# EAGLE design Hot (EAGLE 7.7.0)
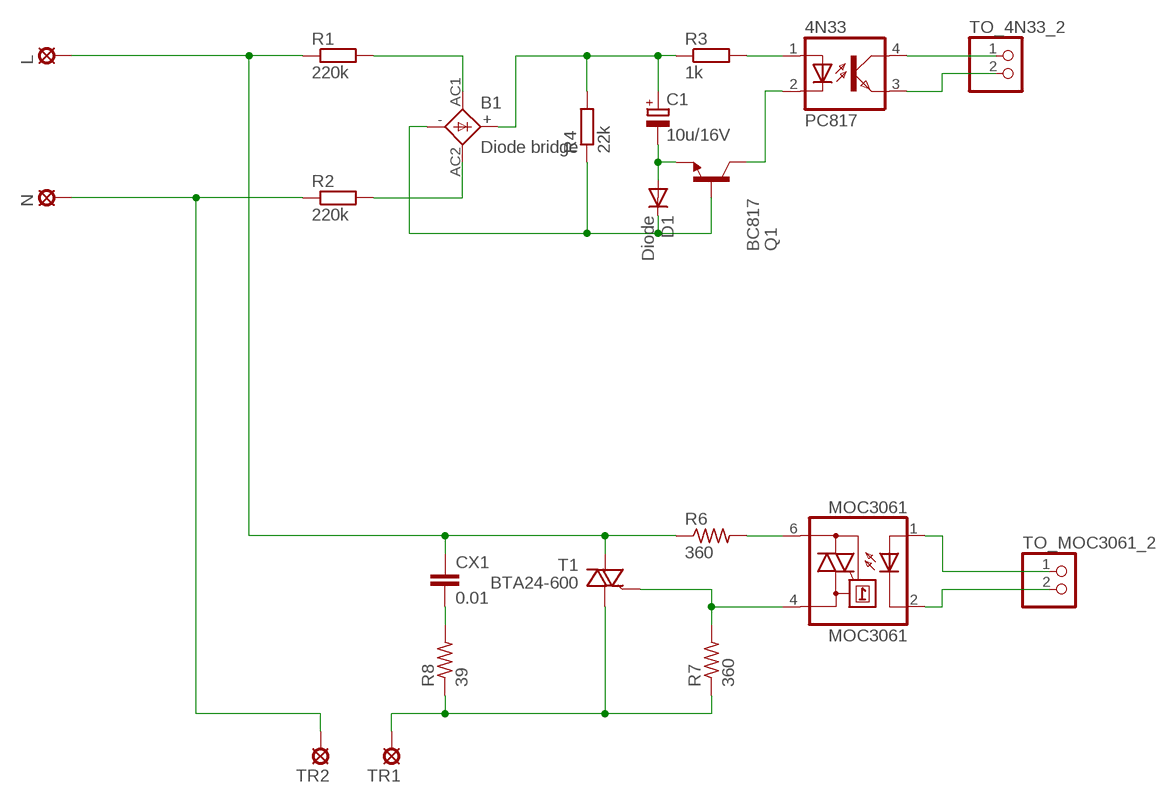
[diagram p0: schematic, sheet 1]

## Parts
4N33  PC817  [DIL04]
B1  Diode bridge  2KBB-R  [2KBB-R]
C1  10u/16V  CPOL-EUE2.5-5  [E2,5-5]
CX1  0.01  CXXC10B6  [XC10B6]
D1  Diode  DIODE-DO-214AC  [DO-214AC]
L  LSP10  [LSP10]
MOC3061  MOC3061  IL410  [DIL06]
N  LSP10  [LSP10]
Q1  BC817  BC817-16LT1SMD  [SOT23-BEC]
R1  220k  R-EU_M1206  [M1206]
R2  220k  R-EU_M1206  [M1206]
R3  1k  R-EU_M1206  [M1206]
R4  22k  R-EU_M1206  [M1206]
R6  360  R-US_VTA54  [VTA54]
R7  360  R-US_VTA54  [VTA54]
R8  39  R-US_VTA52  [VTA52]
T1  BTA24-600  TIC225S  [TO220DS]
TO_4N33_2  PINHD-1X2  [1X02]
TO_MOC3061_2  PINHD-1X2  [1X02]
TR1  LSP10  [LSP10]
TR2  LSP10  [LSP10]

## Nets
L: CX1.1 L.MP R1.1 R6.1 T1.A2
N: N.MP R2.1 TR2.MP
N$1: 4N33.2(C) Q1.C
N$2: C1.- D1.A Q1.E
N$3: 4N33.1(A) R3.2
N$4: B1.AC1 R1.2
N$5: B1.- D1.C Q1.B R4.1
N$6: B1.+ C1.+ R3.1 R4.2
N$7: B1.AC2 R2.2
N$8: MOC3061.4(A1) R7.2 T1.G
N$9: MOC3061.6(A2) R6.2
N$10: CX1.2 R8.2
N$11: R7.1 R8.1 T1.A1 TR1.MP
N$12: 4N33.4(COL) TO_4N33_2.1
N$27: 4N33.3(EMIT) TO_4N33_2.2
N$29: MOC3061.2(C) TO_MOC3061_2.2
TO_MOC3061: MOC3061.1(A) TO_MOC3061_2.1

## Library data of the parts
4N33 = optocoupler:PC817: SHARP OPTO COUPLER
B1 = rectifier:2KBB-R: RECTIFIER grid 3 x 5 mm
C1 = rcl:CPOL-EU: POLARIZED CAPACITOR, European symbol
CX1 = rcl:CX: X CAPACITOR for power line
D1 = diode:DIODE-: DIODE
L N TR1 TR2 = solpad:LSP10: SOLDER PAD drill 1.0 mm, distributor Buerklin, 12H555
MOC3061 = optocoupler:IL410: SIEMENS OPTO COUPLER
Q1 = transistor-npn:BC817*: NPN Transistor
R1-R4 = rcl:R-EU_: RESISTOR, European symbol
R6-R8 = rcl:R-US_: RESISTOR, American symbol
T1 = triac:TIC225S: TRIAC
TO_4N33_2 TO_MOC3061_2 = pinhead:PINHD-1X2: PIN HEADER

## Board
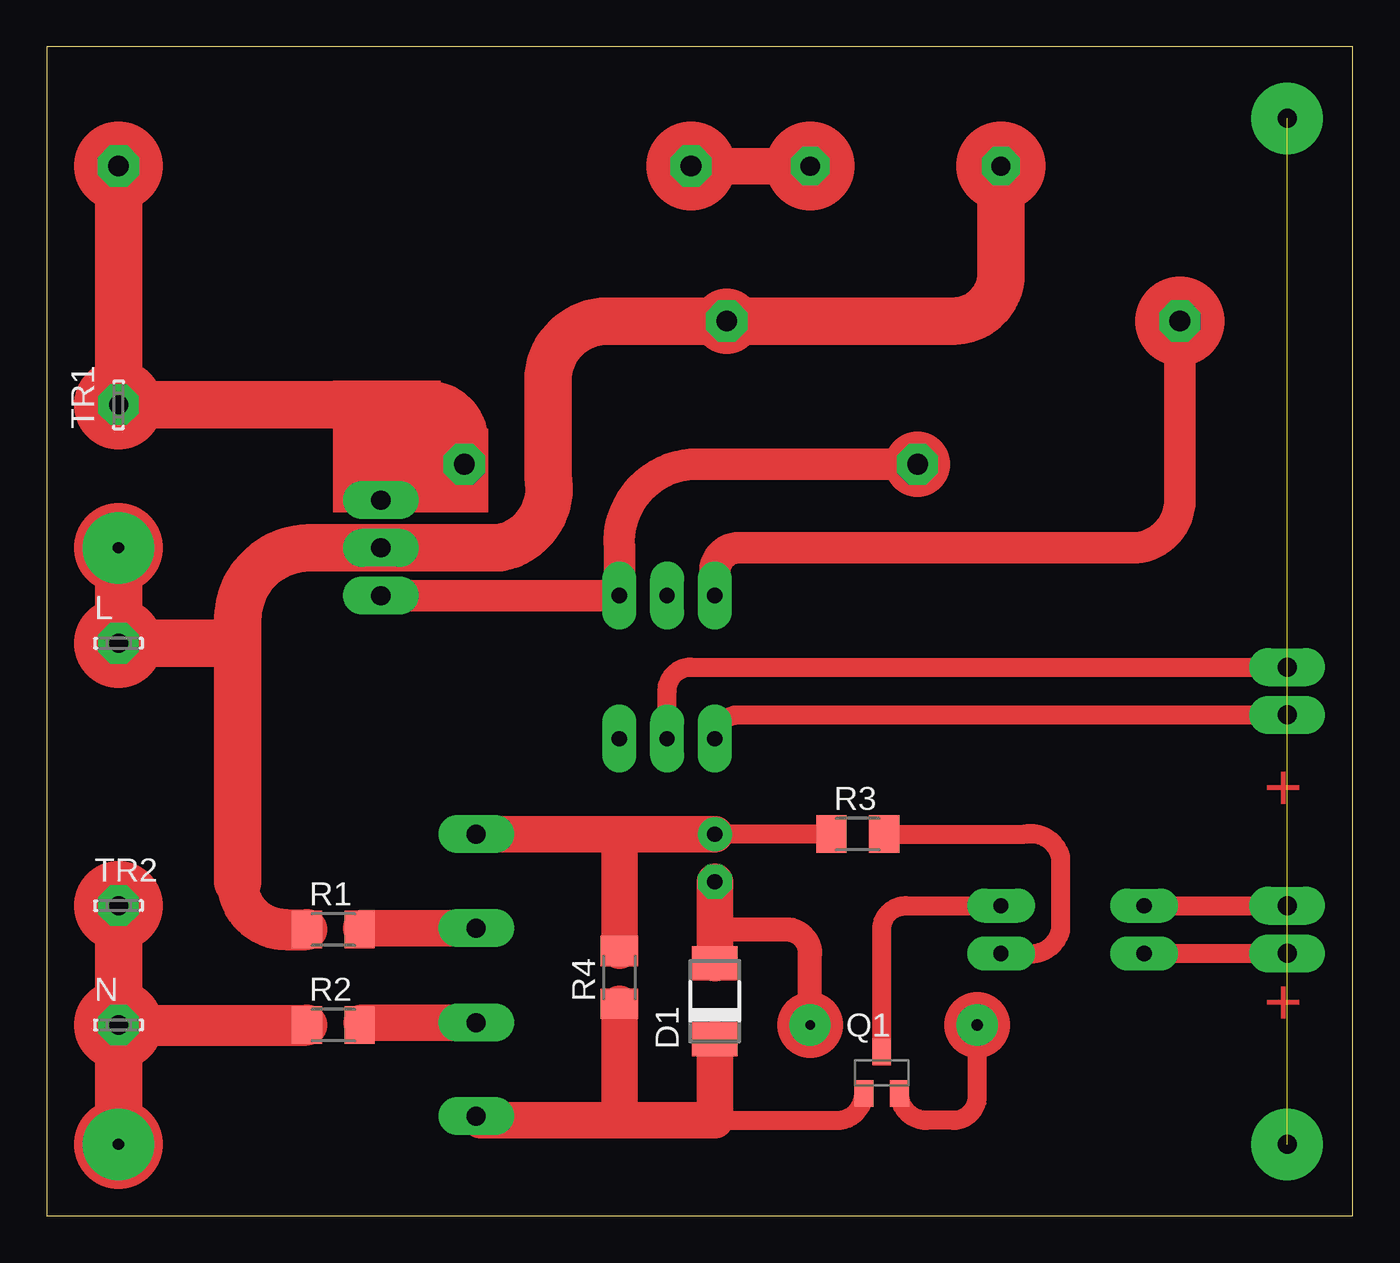
[diagram p1: board, top side]
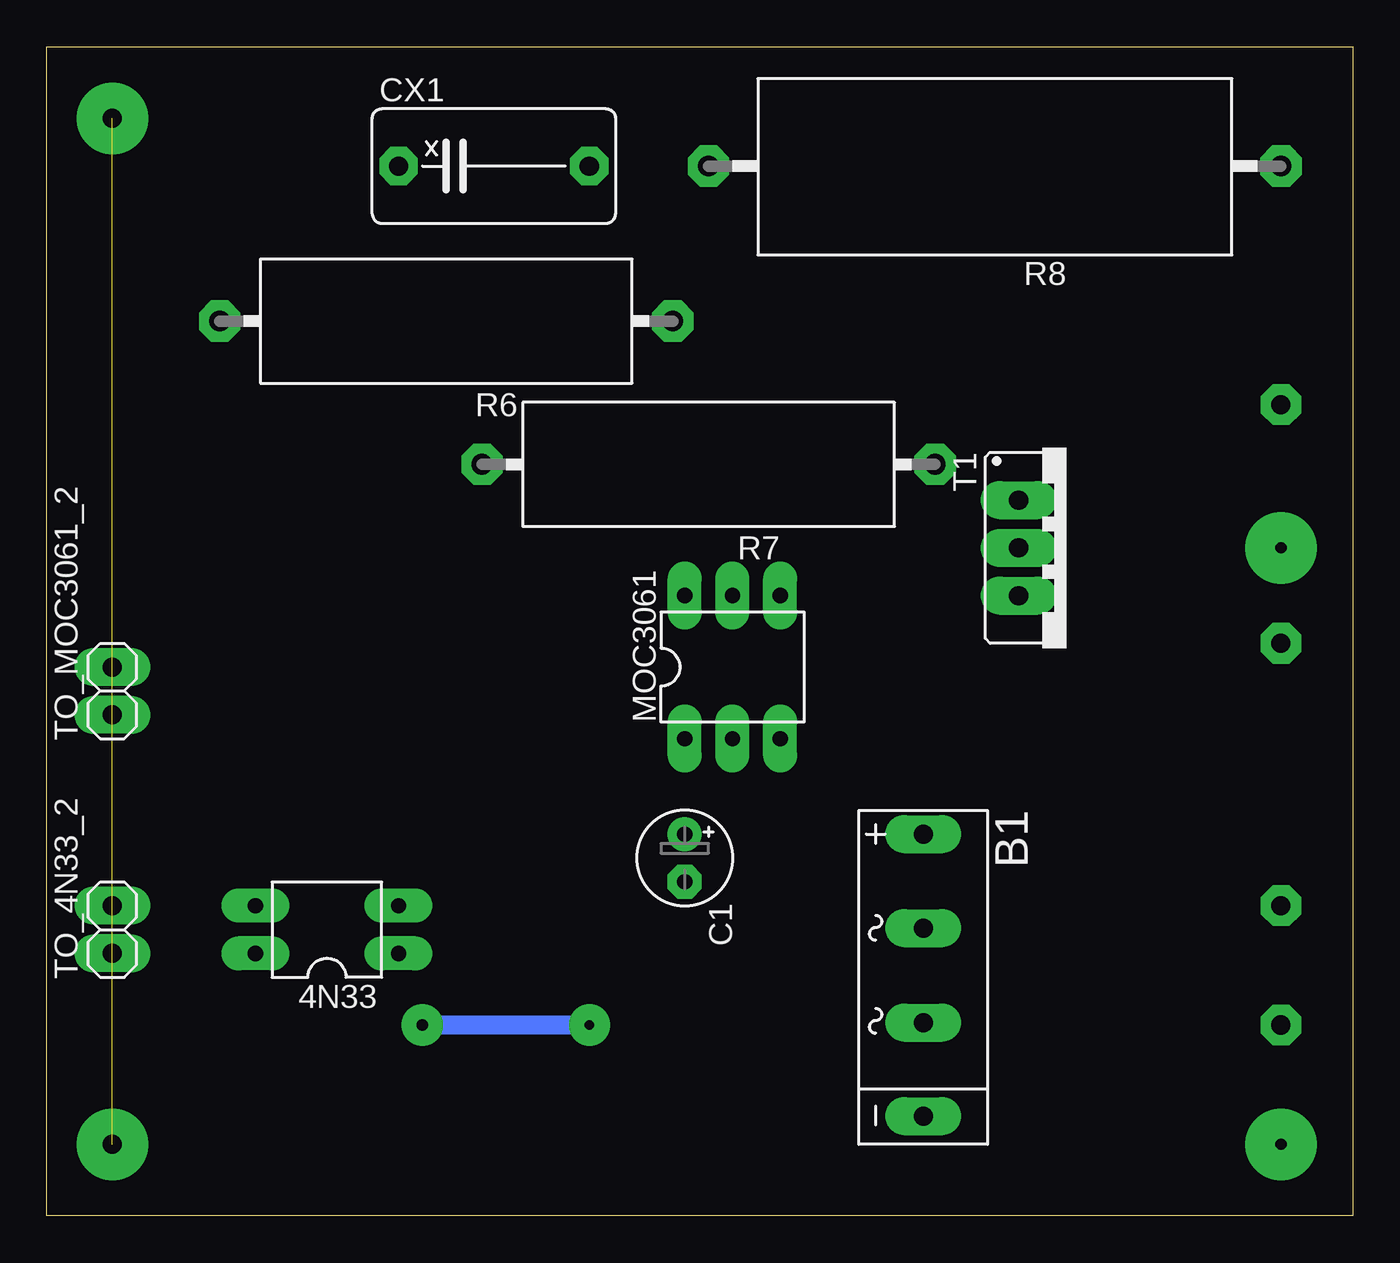
[diagram p2: board, bottom side, seen from below]

Size 69.52 x 62.22 mm. Coordinates in mm from the lower left corner, seen from the top.
Outline: 0,0 69.52,0 69.52,62.22 0,62.22 0,0
Copper layers (1*16): Top 0.035mm / dielectric 1.5mm / Bottom 0.035mm
Design rules "my_default *": minimum track width 0.3mm, minimum drill 0.3mm, track to track 0.15mm, track to pad 0.15mm, pad to pad 0.2mm, via to via 2mm, smd to smd 0.1mm, copper to edge 1.5mm, drill to drill 1.5mm, minimum pad ring 0.5mm, minimum via ring 0.8mm, stop-mask expansion 4mil, vias tented up to drill 0mil, thermal gap 10mil

### Footprints (pad centres in the part's own frame; a part is rotated, then mirrored left to right if it is on the bottom)
DIL04 = drill 0.813 long: 1 -1.27,-3.81; 2 1.27,-3.81; 3 1.27,3.81; 4 -1.27,3.81
2KBB-R = drill 1.016 long: + -7.62,0; - 7.391,0; AC1 -2.616,0; AC2 2.413,0
E2,5-5 = drill 0.813 pad 1.6: + -1.27,0 | drill 0.813 pad 1.6 octagon: - 1.27,0
XC10B6 = drill 1.016 octagon: 1 -5.08,0; 2 5.08,0
DO-214AC = smd 1.8 x 2.4: A 2.025,0; C -2.025,0
LSP10 = drill 1.016 pad 2.159 octagon: MP 0,0
DIL06 = drill 0.813 long: 1 -2.54,-3.81; 2 0,-3.81; 3 2.54,-3.81; 4 2.54,3.81; 5 0,3.81; 6 -2.54,3.81
SOT23-BEC = smd 1 x 1.4: B -0.95,-1.1; C 0,1.1; E 0.95,-1.1
M1206 = smd 1.6 x 2: 1 -1.4,0; 2 1.4,0
VTA54 = drill 1.1 octagon: 1 -12.065,0; 2 12.065,0
VTA52 = drill 1.1 octagon: 1 -15.24,0; 2 15.24,0
TO220DS = drill 1.016 long: A1 -2.54,-2.54; A2 0,-2.54; G 2.54,-2.54
1X02 = drill 1.016 long: 1 -1.27,0; 2 1.27,0

### Placement (x,y rotation side)
4N33  54.61,15.24 90 bottom
B1  22.86,12.7 270 bottom
C1  35.56,19.05 270 bottom
CX1  45.72,55.88 0 bottom
D1  35.56,11.43 90 top
L  3.81,30.48 0 top
MOC3061  33.02,29.21 0 bottom
N  3.81,10.16 0 top
Q1  44.45,7.62 0 top
R1  15.24,15.24 0 top
R2  15.24,10.16 0 top
R3  43.18,20.32 0 top
R4  30.48,12.7 90 top
R6  48.26,47.62 180 bottom
R7  34.29,40.01 180 bottom
R8  19.05,55.88 180 bottom
T1  15.24,35.56 270 bottom
TO_4N33_2  66.04,15.24 90 bottom
TO_MOC3061_2  66.04,27.94 90 bottom
TR1  3.81,43.18 90 top
TR2  3.81,16.51 0 top

### Tracks (layer width: path | path; a pad name or v marks a point on that pad's centre or on a via)
GND  (via drill 1 pad 3.81)  (1 unrouted)
  other vias: 66.04,58.42 66.04,3.81
L  (via drill 0.6 pad 3.81)
  Top 1.93: 8.89,30.48 arc90 10.16,31.75
  Top 2.184: 10.16,17.78 arc90 12.7,15.24 R1.1
  Top 2.54: v3.81,35.56 L.MP 8.89,30.48 | 10.16,17.78 10.16,31.75 arc-90 13.97,35.56 T1.A2 24.13,35.56 arc90 26.67,39.37 26.67,44.45 arc-90 29.84,47.62 R6.1 48.26,47.62 arc90 50.8,50.16 CX1.1
N  (via drill 0.6 pad 3.81)
  Top 2.184: N.MP R2.1
  Top 2.54: v3.81,3.81 N.MP TR2.MP
N$1
  Top 1: Q1.C 44.45,15.24 arc-90 45.72,16.51 4N33.2
N$2  (via drill 0.5 pad 2.18, 0.6 pad 2.18)
  Top 1: v49.53,10.16 49.53,6.35 arc-90 48.26,5.08 46.84,5.08 arc-90 Q1.E
  Top 1.27: v40.64,10.16 40.64,13.97 arc90 39.37,15.24 35.56,15.24
  Top 1.93: D1.A 35.56,15.24 C1.-
  Bottom 1: v40.64,10.16 v49.53,10.16
N$3
  Top 1: R3.2 52.07,20.32 arc-90 53.98,19.05 53.98,15.24 arc-90 52.07,13.97 4N33.1
N$4
  Top 1: R1.2 arc-90 16.72,15.32
  Top 1.93: 16.72,15.32 B1.AC1
N$5
  Top 1: B1.- arc90 23.09,5.08 | 35.56,5.08 42.06,5.08 arc90 Q1.B
  Top 1.93: 23.09,5.08 30.48,5.08 | 30.48,5.08 35.56,5.08 D1.C | R4.1 30.48,5.08
N$6
  Top 1: R3.1 C1.+
  Top 1.93: B1.+ 30.48,20.32 | 30.48,20.32 C1.+ | R4.2 30.48,20.32
N$7
  Top 1: R2.2 arc-90 16.77,10.29
  Top 1.93: 16.77,10.29 B1.AC2
N$8
  Top 1.676: T1.G MOC3061.4 30.48,35.56 arc-90 34.29,40.01 R7.2
N$9
  Top 1.676: MOC3061.6 35.56,34.29 arc-90 36.83,35.56 57.78,35.56 arc90 60.33,38.1 R6.2
N$10
  Top 1.93: R8.2 CX1.2
N$11
  Top 1.93: T1.A1 R7.1 22.23,41.27
  Top 2.54: R8.1 TR1.MP 20.32,43.18 arc-90 22.23,41.27
N$12
  Top 1: 4N33.4 TO_4N33_2.1
N$27
  Top 1: 4N33.3 TO_4N33_2.2
N$29
  Top 1.016: MOC3061.2 33.02,27.94 arc-90 34.29,29.21 TO_MOC3061_2.2
TO_MOC3061
  Top 1.016: MOC3061.1 arc-90 36.83,26.67 TO_MOC3061_2.1
(copper drawn outside any net)
  shapes: Top area x2, Top circle x16

### Text on the board
Top: + | +